# Altium schematic sheet WATCHDOG.SchDoc
size 420 x 297 mm; SheetNumber: 4; SheetTotal: 4
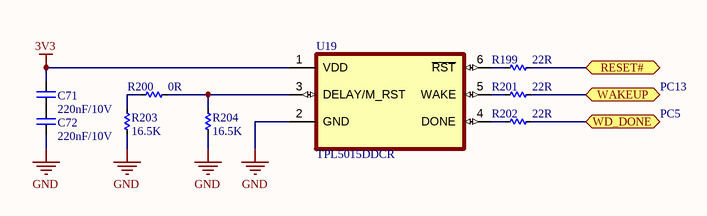
[diagram p0: WATCHDOG.SchDoc]

## Parts
C71  220nF/10V  [CAP_C_1608X80]
C72  220nF/10V  [CAP_C_1608X80]
R199  22R  [RES_C_1608X60]
R200  0R  [RES_C_1608X60]
R201  22R  [RES_C_1608X60]
R202  22R  [RES_C_1608X60]
R203  16.5K  [RES_C_1608X60]
R204  16.5K  [RES_C_1608X60]
U19  TPL5015DDCR  [TPL5010DDCR]

## Ports
RESET# (bidir), WAKEUP (bidir), WD_DONE (bidir)

## Nets
3V3: C71.2 U19.1(VDD)
GND: C72.1 R203.1 R204.1 U19.2(GND)
RESET#: R199.2 ; port RESET#
WAKEUP: R201.2 ; port WAKEUP
WD_DONE: R202.2 ; port WD_DONE
NetC71_1: C71.1 C72.2
NetR199_1: R199.1 U19.6(~{RST})
NetR200_1: R200.1 R203.2
NetR200_2: R200.2 R204.2 U19.3(DELAY/M_RST)
NetR201_1: R201.1 U19.5(WAKE)
NetR202_1: R202.1 U19.4(DONE)

## Notes on the sheet
- PC13
- PC5
- Sub-system:
- Design by:
- Sheet title:
- Project:
- Sheet:
- of
- Checked by:
- Approved by:
- Doc no:
- Revision:
- Size:
- Date:

## Library data of the parts
C71 C72 = CAP_SMD: CAP_Chip; Value: 33pF
R199-R204 = _RES_B_2: RES
U19 = TPL5015DDCR: OSC PROG TIMER TSOT23-6